# Altium schematic sheet BalancingNetwork.SchDoc
size A4; CompanyName: Hydriven; Organization: Hydriven; Revision: V1.1; SheetNumber: 3; SheetTotal: 3; Team: 2025; Subsystem: Embedded Systems
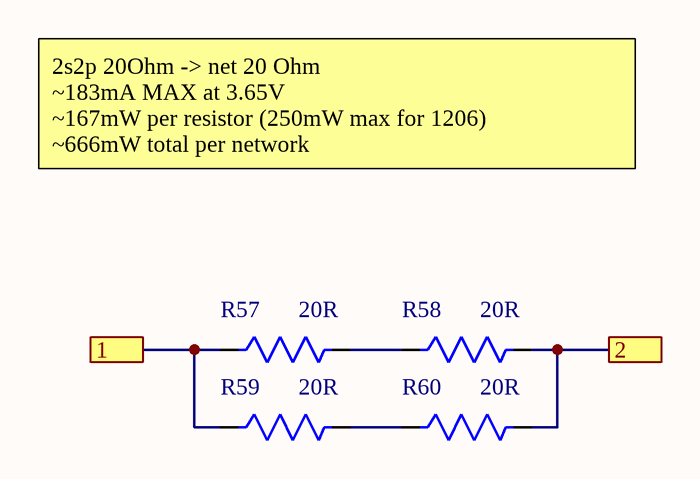
[diagram p0: BalancingNetwork.SchDoc]

## Parts
R57  value 20R  [RES_SM1206_YAGEORC_N]  (hidden comment: RES 1206 20R 1%)
R58  value 20R  [RES_SM1206_YAGEORC_N]  (hidden comment: RES 1206 20R 1%)
R59  value 20R  [RES_SM1206_YAGEORC_N]  (hidden comment: RES 1206 20R 1%)
R60  value 20R  [RES_SM1206_YAGEORC_N]  (hidden comment: RES 1206 20R 1%)

## Ports
1, 2

## Nets
1: R57.1 R59.1 ; port 1
2: R58.2 R60.2 ; port 2
NetR57_2: R57.2 R58.1
NetR59_2: R59.2 R60.1

## Notes on the sheet
- 2s2p 20Ohm -> net 20 Ohm
  ~183mA MAX at 3.65V
  ~167mW per resistor (250mW max for 1206)
  ~666mW total per network
- Team
- Authors
- Revision
- Title
- Project
- Subsystem
- File
- Sheet
- //

## Library data of the parts
R57-R60 = CMP-009-00208-3: GTT Standard 1206 Resistor; Voltage Rating: 50V; Power: 250mW; Mounting Technology: SMD; Tolerance: 1%; Case/Package: 1206; JLCPCB Part #: C17955